# Altium schematic sheet Li-Ion charger.SchDoc
size A
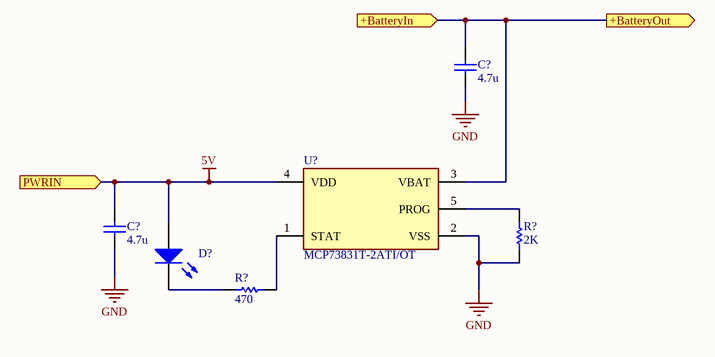
[diagram p0: Li-Ion charger.SchDoc]

## Parts
(Parts that share a designator on the sheet are numbered #1, #2 ... from top to bottom, then left to right.)
C?#1  value 4.7u  (hidden comment: Capacitor)
C?#2  value 4.7u  (hidden comment: Capacitor)
D?  Light-Emitting Diode  (value not drawn)
R?#1  value 2K  (hidden comment: Resistor)
R?#2  value 470  (hidden comment: Resistor)
U?  MCP73831T-2ATI/OT  [FP-C04-091-OT-IPC_C]

## Ports
+BatteryIn (in), +BatteryOut (out), PWRIN (in)

## Nets
5V: C?#2.2 D?.1(A) U?.4(VDD) ; port PWRIN
GND: C?#1.1 C?#2.1 R?#1.1 U?.2(VSS)
+BatteryIn: C?#1.2 U?.3(VBAT) ; port +BatteryIn, port +BatteryOut
NetD?_2: D?.2(K) R?#2.2
NetR?#1_2: R?#1.2 U?.5(PROG)
NetR?#2_1: R?#2.1 U?.1(STAT)

## Library data of the parts
C?#1 C?#2 = Capacitor: SimulationGenericComponent: True
D? = LED: AF: 1; BV: 0; BV_MAX: 1e99; EG: 1.11; FC: 0.5; IBV: 0.001; IS: 1e-14; MJSW: 0.33; NTUN: 30; TNOM: 27; XTI: 3; SimulationGenericComponent: True; CJO: 0; CJP: 0; CTA: 0; CTP: 0; FCS: 0.5; FV_MAX: 1e99; IKF: 0; IKR: 0; ISR: 1e-14; JSW: 0; JTUN: 0; JTUNSW: 0; KEG: 1; KF: 0; LEVEL: 1; N: 1; NBV: 1; NR: 1; NS: 1; PHP: 1; RS: 0; TCV: 0; TLEV: 0; TLEVC: 0; TM1: 0; TM2: 0; TPB: 0; TPHP: 0; TRS: 0; TRS2: 0; TT: 0; TTT1: 0; TTT2: 0; VJ: 1; XTITUN: 3
R?#1 R?#2 = Resistor: TC1: 0; SimulationGenericComponent: True; TC2: 0
U? = CMP-0133-00144-2: IC CONTROLLR LI-ION 4.2V SOT23-5; Max Supply Voltage: 6V; Max Output Current: 500mA; Min Output Voltage: 4.168V; Max Output Voltage: 4.232V; Min Supply Voltage: 3.75V; Number of Cells: 1; Lead Free: Lead Free; Number of Pins: 5; Package Quantity: 3000; Min Operating Temperature: -40°C; Width: 1.8mm; Max Charge Current: 500mA; Output Current: 500mA; Packaging: Tape and Reel; Height: 1.3mm; Output Voltage: 4.2V; Max Operating Temperature: 85°C; Mount: Surface Mount; Case/Package: SOT-23; Length: 3.1mm; REACH SVHC: No SVHC